# EasyEDA schematic SCH_Battery_level_indicator_2025-08-23.json
TITLE: Battery Monitor Schematic; REV: 1.0; Date: 2025-07-22; Sheet: 1/1; Drawn By: akshitsingh658; Company: Akshit Singh
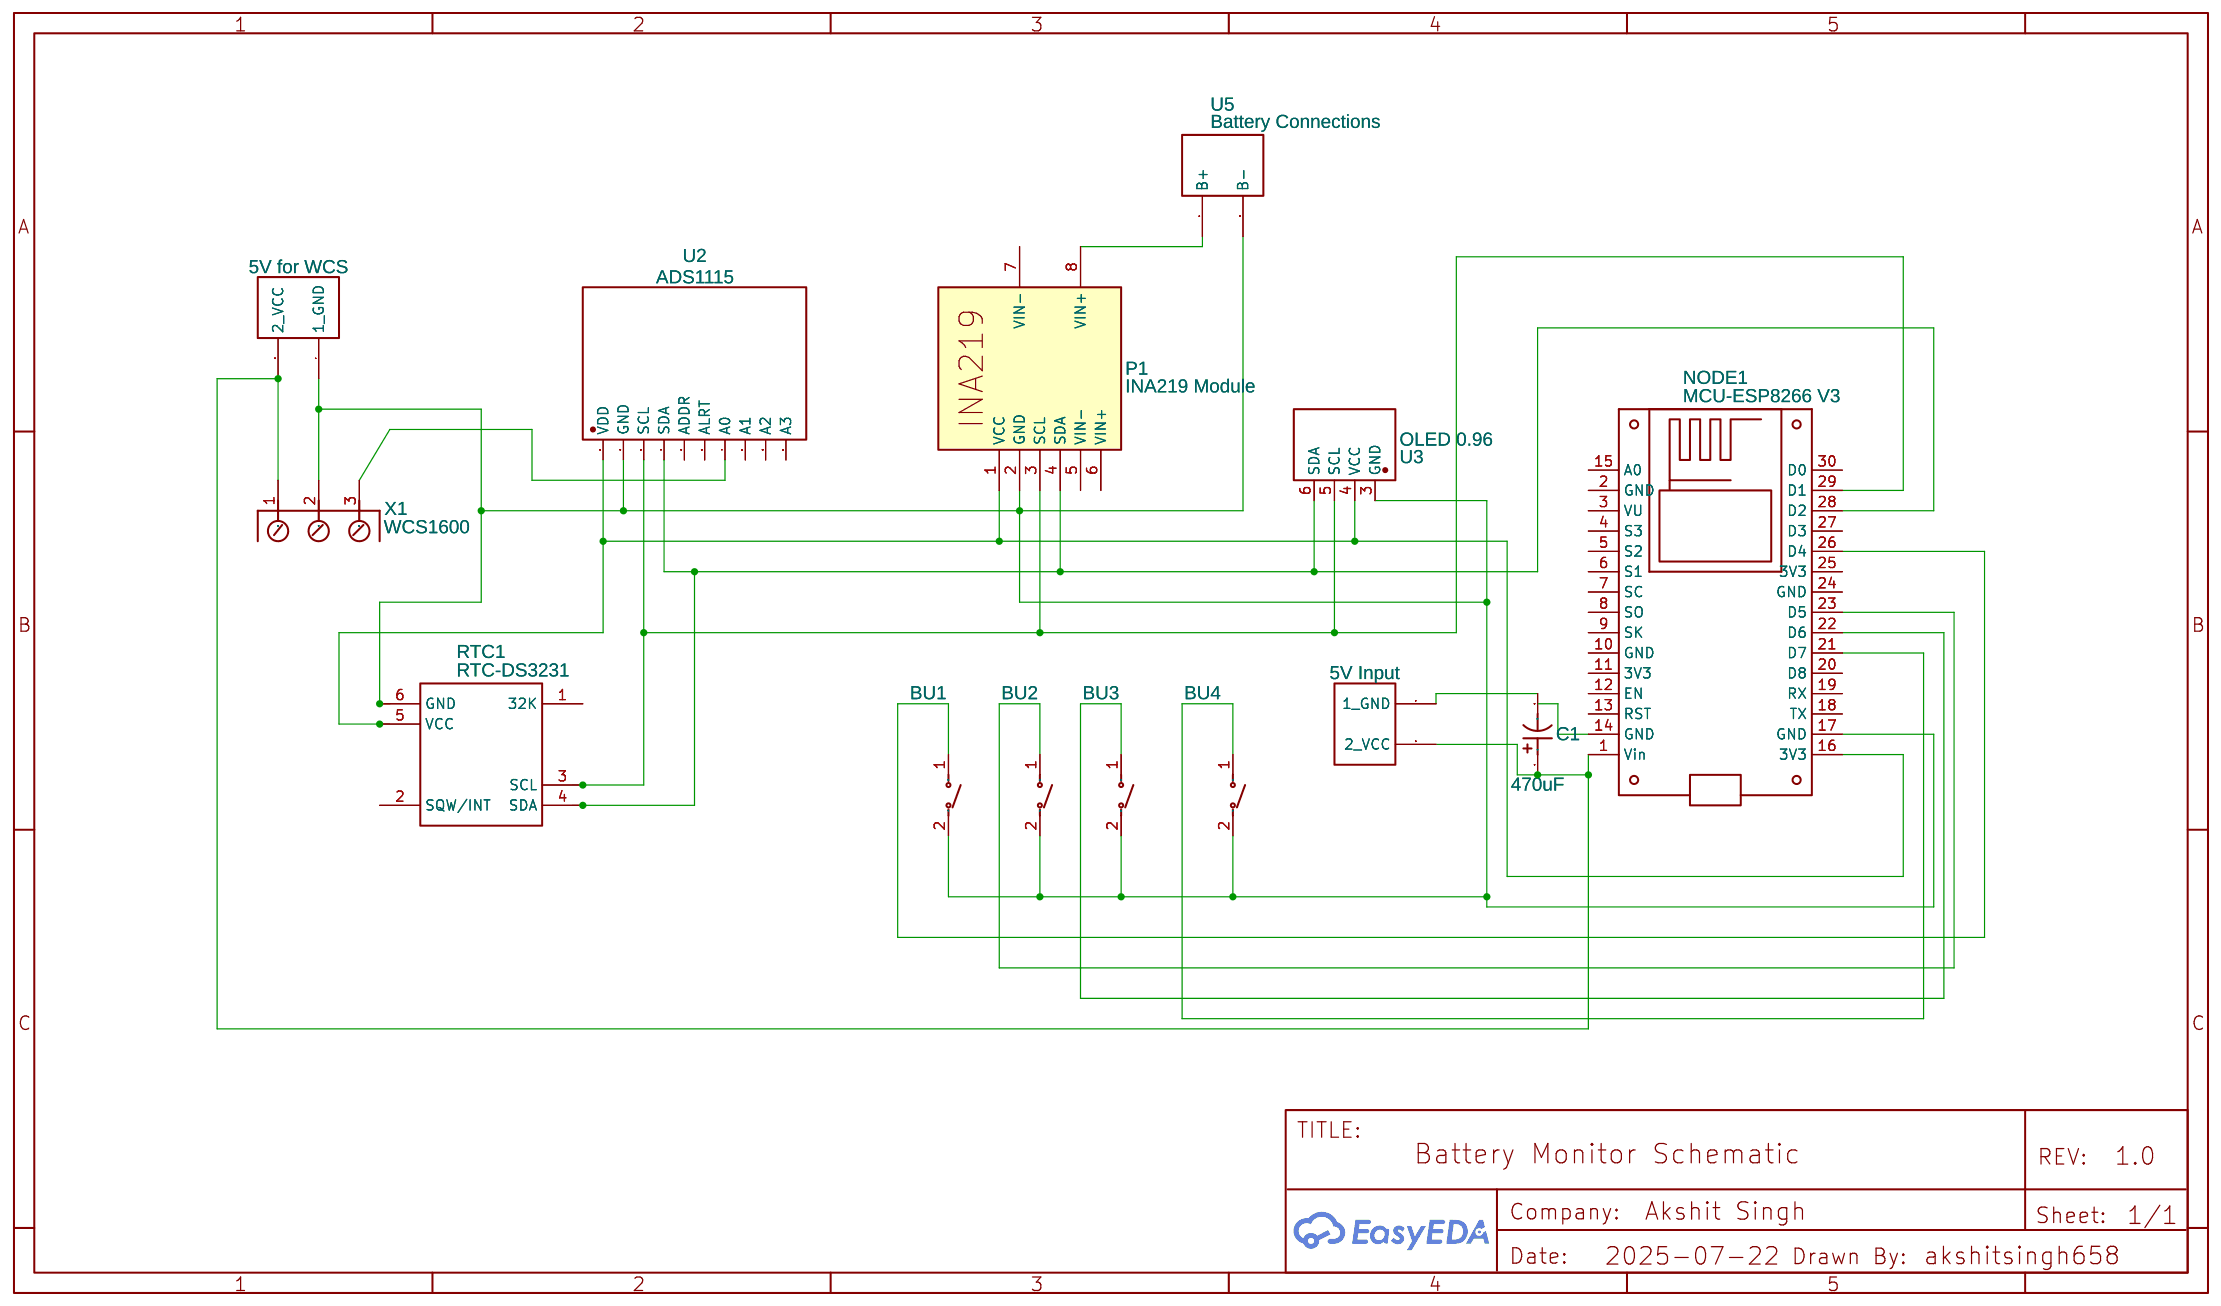
[diagram p0: schematic sheet]

## Parts
BU1  Right Reverse  [PUSHBUTTON]
BU2  Right Reverse  [PUSHBUTTON]
BU3  Right Reverse  [PUSHBUTTON]
BU4  Right Reverse  [PUSHBUTTON]
C1  470uF  [CAP-TH_BD8.0-P3.50-D0.5-FD]
NODE1  MCU-ESP8266 V3  [NODEMCU-12E;NODEMCU-ESP8266]
P1  INA219 Module  [INA219 MODULE]
RTC1  RTC-DS3231  [RTC-DS3231-MOD]
U1  5V Input  [SCREW TERMINAL BLOCK (2)]
U2  ADS1115  [ADS1115]
U3  OLED 0.96  [OLED-TH_OLED0.96-I2C]
U4  5V for WCS  [SCREW TERMINAL BLOCK (2)]
U5  Battery Connections  [SCREW TERMINAL BLOCK (2)]
X1  WCS1600  [AKL701_3_15]

## Library data of the parts
BU1-BU4 = Pushbutton: Supplier: LCSC; Supplier Part: C9900009018; Manufacturer: null; Manufacturer Part: BUTTON2-3*6*2.5; Contributor: Sunil Sinsinwar; JLCPCB Part Class: Extended Part
C1 = 16V470UF CD110: Contributor: LCSC; Supplier: LCSC; Supplier Part: C2960230; Manufacturer: HRK(鸿瑞凯电子); Manufacturer Part: 16V470uF CD110; JLCPCB Part Class: Extended Part
NODE1 = MCU-ESP8266 V3: Contributor: Tinerfe; Supplier: TME
P1 = INA219 Module: sourceId: 1T5FDZYC8; Contributor: Tommy Budimulyo
RTC1 = RTC-DS3231: Contributor: madanlal1960
U1 U4 U5 = Screw terminal block (2): Contributor: 315151
U2 = ADS1115: Contributor: neodd70
U3 = OLED 0.96 COPY: Supplier Part: AZDelivery; Manufacturer: AZDelivery; Manufacturer Part: ZJY096S0700BG01蓝色; link: https://img.jlc.com/pdf/applyPasteComponent/2022-08-15/203417A/337c2d88c1b34c958220578f8c1ccd46/ZJY096S0700WG01.pdf; Contributor: tonysandberg69
X1 = AKL701_3_15

## Nets
Net-(BU1-1): BU1.1 NODE1.26(D4)
Net-(BU1-2): BU1.2 BU2.2 BU3.2 BU4.2 NODE1.17(GND) P1.2(GND) RTC1.6(GND) U2.2(GND) U3.3(GND) U4.1(1 GND) U5.2(B-) X1.2
Net-(BU2-1): BU2.1 NODE1.23(D5)
Net-(BU3-1): BU3.1 NODE1.22(D6)
Net-(BU4-1): BU4.1 NODE1.21(D7)
Net-(C1-1): C1.1 NODE1.1(Vin) U1.2(2 VCC) U4.2(2 VCC) X1.1
Net-(C1-2): C1.2 U1.1(1 GND)
Net-(NODE1-16): NODE1.16(3V3) P1.1(VCC) RTC1.5(VCC) U2.1(VDD) U3.4(VCC)
Net-(NODE1-28): NODE1.28(D2) P1.4(SDA) RTC1.4(SDA) U2.4(SDA) U3.6(SDA)
Net-(NODE1-29): NODE1.29(D1) P1.3(SCL) RTC1.3(SCL) U2.3(SCL) U3.5(SCL)
Net-(P1-8): P1.8(VIN+) U5.1(B+)
Net-(U2-7): U2.7(A0) X1.3

Not connected (* = marked no-connect by the designer): NODE1 2(GND) 3(VU) 4(S3) 5(S2) 6(S1) 7(SC) 8(SO) 9(SK) 10(GND) 11(3V3) 12(EN) 13(RST) 14(GND) 15(A0) 18(TX) 19(RX) 20(D8) 24(GND) 25(3V3) 27(D3) 30(D0); P1 5(VIN-) 6(VIN+) 7(VIN-); RTC1 1(32K) 2(SQW/INT); U2 5(ADDR) 6(ALRT) 8(A1) 9(A2) 10(A3)
